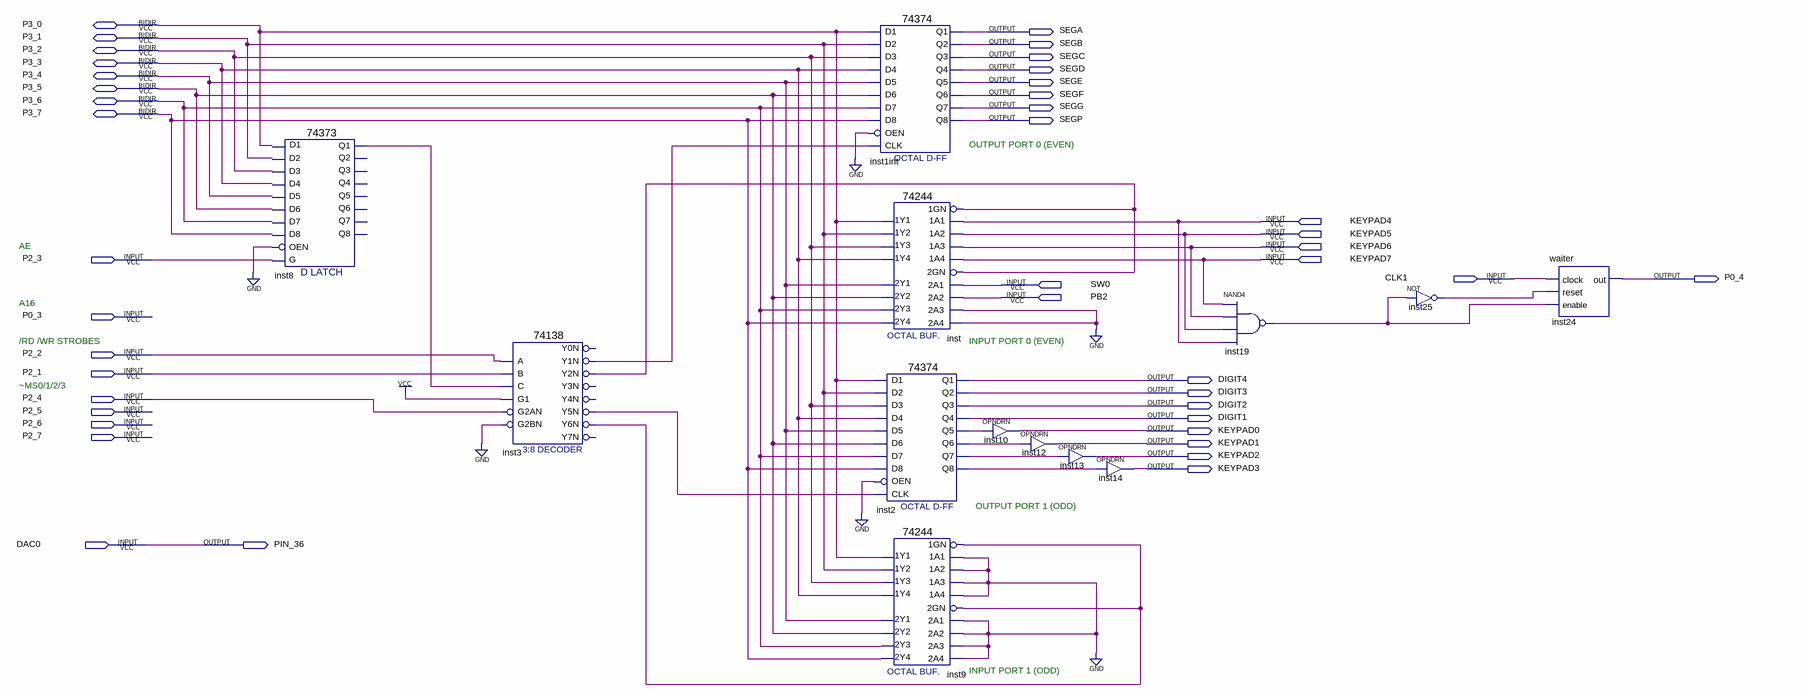
[diagram p0: schematic sheet]
// Quartus schematic ece315_top.bdf as structural Verilog: 13 symbols, 42 pins
module ece315_top (
  input  KEYPAD4,
  input  KEYPAD5,
  input  KEYPAD6,
  input  P2_3,
  input  KEYPAD7,
  input  CLK1,
  input  SW0,
  input  PB2,
  input  P0_3,
  input  P2_2,
  input  P2_1,
  input  P2_4,
  input  P2_5,
  input  P2_6,
  input  P2_7,
  input  DAC0,
  inout  P3_0,
  inout  P3_1,
  inout  P3_2,
  inout  P3_3,
  inout  P3_4,
  inout  P3_5,
  inout  P3_6,
  inout  P3_7,
  output SEGA,
  output SEGB,
  output SEGC,
  output SEGD,
  output SEGE,
  output SEGF,
  output SEGG,
  output SEGP,
  output P0_4,
  output DIGIT4,
  output DIGIT3,
  output DIGIT2,
  output DIGIT1,
  output KEYPAD0,
  output KEYPAD1,
  output KEYPAD2,
  output KEYPAD3,
  output PIN_36
);

  wire inst2_q5, inst2_q6, inst2_q7, inst2_q8, inst3_y1n, inst3_y2n, inst3_y5n, inst3_y6n, inst8_q1,
       inst19_out, inst25_out;

  \74373  inst8 (
    .D1(P3_0), .D3(P3_2), .D6(P3_5), .D7(P3_6), .D2(P3_1), .G(P2_3), .D4(P3_3), .D5(P3_4), .D8(P3_7),
    .OEN(1'b0), .Q1(inst8_q1));  // open: Q3, Q6, Q7, Q2, Q8, Q4, Q5
  \74138  inst3 (
    .A(P2_2), .B(P2_1), .G1(1'b1), .C(inst8_q1), .G2AN(P2_4), .G2BN(1'b0), .Y1N(inst3_y1n), .Y2N(inst3_y2n),
    .Y5N(inst3_y5n), .Y6N(inst3_y6n));  // open: Y0N, Y3N, Y4N, Y7N
  \74374  inst1int (
    .D1(P3_0), .D2(P3_1), .D3(P3_2), .D4(P3_3), .D6(P3_5), .D5(P3_4), .OEN(1'b0), .D8(P3_7), .D7(P3_6),
    .CLK(inst3_y1n), .Q2(SEGB), .Q3(SEGC), .Q5(SEGE), .Q4(SEGD), .Q6(SEGF), .Q7(SEGG), .Q8(SEGP), .Q1(SEGA));
  \74244  inst (
    .\1A2 (KEYPAD5), .\1A4 (KEYPAD7), .\1A1 (KEYPAD4), .\1A3 (KEYPAD6), .\1GN (inst3_y2n), .\2A3 (1'b0),
    .\2GN (inst3_y2n), .\2A1 (SW0), .\2A4 (1'b0), .\2A2 (PB2), .\1Y2 (P3_1), .\1Y4 (P3_3), .\2Y1 (P3_4),
    .\1Y1 (P3_0), .\2Y3 (P3_6), .\2Y4 (P3_7), .\1Y3 (P3_2), .\2Y2 (P3_5));
  \74374  inst2 (
    .D1(P3_0), .D2(P3_1), .D3(P3_2), .D4(P3_3), .D6(P3_5), .D5(P3_4), .OEN(1'b0), .D8(P3_7), .D7(P3_6),
    .CLK(inst3_y5n), .Q2(DIGIT3), .Q3(DIGIT2), .Q5(inst2_q5), .Q4(DIGIT1), .Q6(inst2_q6), .Q7(inst2_q7),
    .Q8(inst2_q8), .Q1(DIGIT4));
  \74244  inst9 (
    .\1A2 (1'b0), .\1A4 (1'b0), .\1A1 (1'b0), .\1A3 (1'b0), .\1GN (inst3_y6n), .\2A3 (1'b0),
    .\2GN (inst3_y6n), .\2A1 (1'b0), .\2A4 (1'b0), .\2A2 (1'b0), .\1Y2 (P3_1), .\1Y4 (P3_3), .\2Y1 (P3_4),
    .\1Y1 (P3_0), .\2Y3 (P3_6), .\2Y4 (P3_7), .\1Y3 (P3_2), .\2Y2 (P3_5));
  OPNDRN inst10 (.IN(inst2_q5), .OUT(KEYPAD0));
  OPNDRN inst12 (.IN(inst2_q6), .OUT(KEYPAD1));
  OPNDRN inst13 (.IN(inst2_q7), .OUT(KEYPAD2));
  OPNDRN inst14 (.IN(inst2_q8), .OUT(KEYPAD3));
  nand inst19 (inst19_out, KEYPAD7, KEYPAD6, KEYPAD5, KEYPAD4);
  not inst25 (inst25_out, inst19_out);
  waiter inst24 (.clock(CLK1), .reset(inst25_out), .enable(inst19_out), .out(P0_4));

  assign PIN_36 = DAC0;

  // Notes on the sheet:
  //   OUTPUT PORT 0 (EVEN)
  //   AE
  //   A16
  //   /RD /WR STROBES
  //   INPUT PORT 0 (EVEN)
  //   ~MS0/1/2/3
  //   OUTPUT PORT 1 (ODD)
  //   INPUT PORT 1 (ODD)
endmodule
